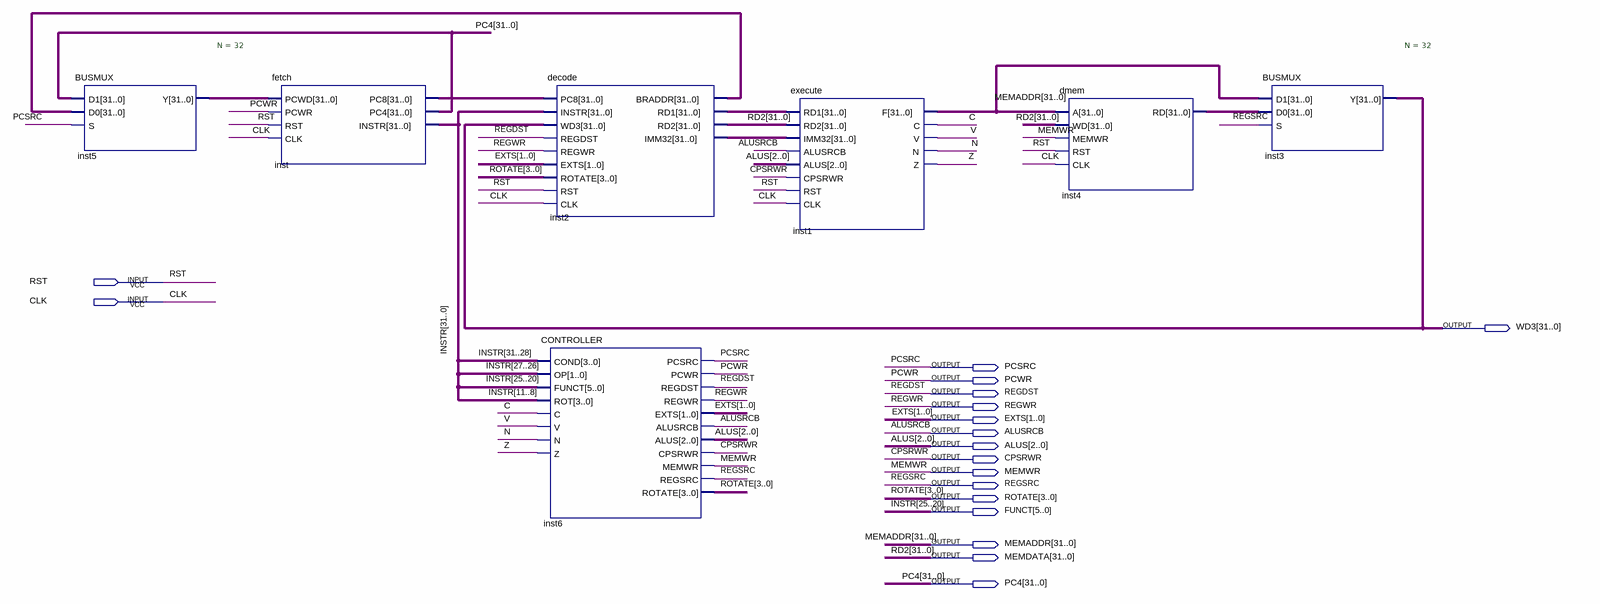
[diagram p0: schematic sheet]
// Quartus schematic scp.bdf as structural Verilog: 7 symbols, 18 pins
module scp (
  input  RST,
  input  CLK,
  output [31:0] WD3,
  output PCSRC,
  output PCWR,
  output REGDST,
  output REGWR,
  output [1:0] EXTS,
  output ALUSRCB,
  output [2:0] ALUS,
  output CPSRWR,
  output MEMWR,
  output REGSRC,
  output [3:0] ROTATE,
  output [5:0] FUNCT,
  output [31:0] MEMADDR,
  output [31:0] MEMDATA,
  output [31:0] PC4
);

  wire C, N, V, Z;
  wire [31:0] inst2_braddr, inst2_imm32, inst2_rd1, inst4_rd, inst5_y, inst_pc8, INSTR;

  BUSMUX #(.N(32)) inst5 (.D1(PC4), .D0(inst2_braddr), .S(PCSRC), .Y(inst5_y));
  fetch inst (
    .PCWD(inst5_y), .PCWR(PCWR), .RST(RST), .CLK(CLK), .PC8(inst_pc8), .PC4(PC4),
    .INSTR({INSTR[31:26], FUNCT, INSTR[19:0]}));
  decode inst2 (
    .PC8(inst_pc8), .INSTR({INSTR[31:26], FUNCT, INSTR[19:0]}), .WD3(WD3), .REGDST(REGDST), .REGWR(REGWR),
    .EXTS(EXTS), .ROTATE(ROTATE), .RST(RST), .CLK(CLK), .BRADDR(inst2_braddr), .RD1(inst2_rd1),
    .RD2(MEMDATA), .IMM32(inst2_imm32));
  CONTROLLER inst6 (
    .COND(INSTR[31:28]), .OP(INSTR[27:26]), .FUNCT(FUNCT), .ROT(INSTR[11:8]), .C(C), .V(V), .N(N), .Z(Z),
    .PCSRC(PCSRC), .PCWR(PCWR), .REGDST(REGDST), .REGWR(REGWR), .EXTS(EXTS), .ALUSRCB(ALUSRCB), .ALUS(ALUS),
    .CPSRWR(CPSRWR), .MEMWR(MEMWR), .REGSRC(REGSRC), .ROTATE(ROTATE));
  execute inst1 (
    .RD1(inst2_rd1), .RD2(MEMDATA), .IMM32(inst2_imm32), .ALUSRCB(ALUSRCB), .ALUS(ALUS), .CPSRWR(CPSRWR),
    .RST(RST), .CLK(CLK), .F(MEMADDR), .C(C), .V(V), .N(N), .Z(Z));
  dmem inst4 (.A(MEMADDR), .WD(MEMDATA), .MEMWR(MEMWR), .RST(RST), .CLK(CLK), .RD(inst4_rd));
  BUSMUX #(.N(32)) inst3 (.D1(MEMADDR), .D0(inst4_rd), .S(REGSRC), .Y(WD3));

  // Other names for the same wires on the sheet: INSTR[25:20] = FUNCT; RD2[31:0] = MEMDATA
endmodule
